# EAGLE design DensityAltitude_BME280_7SEG (EAGLE 7.2.0)
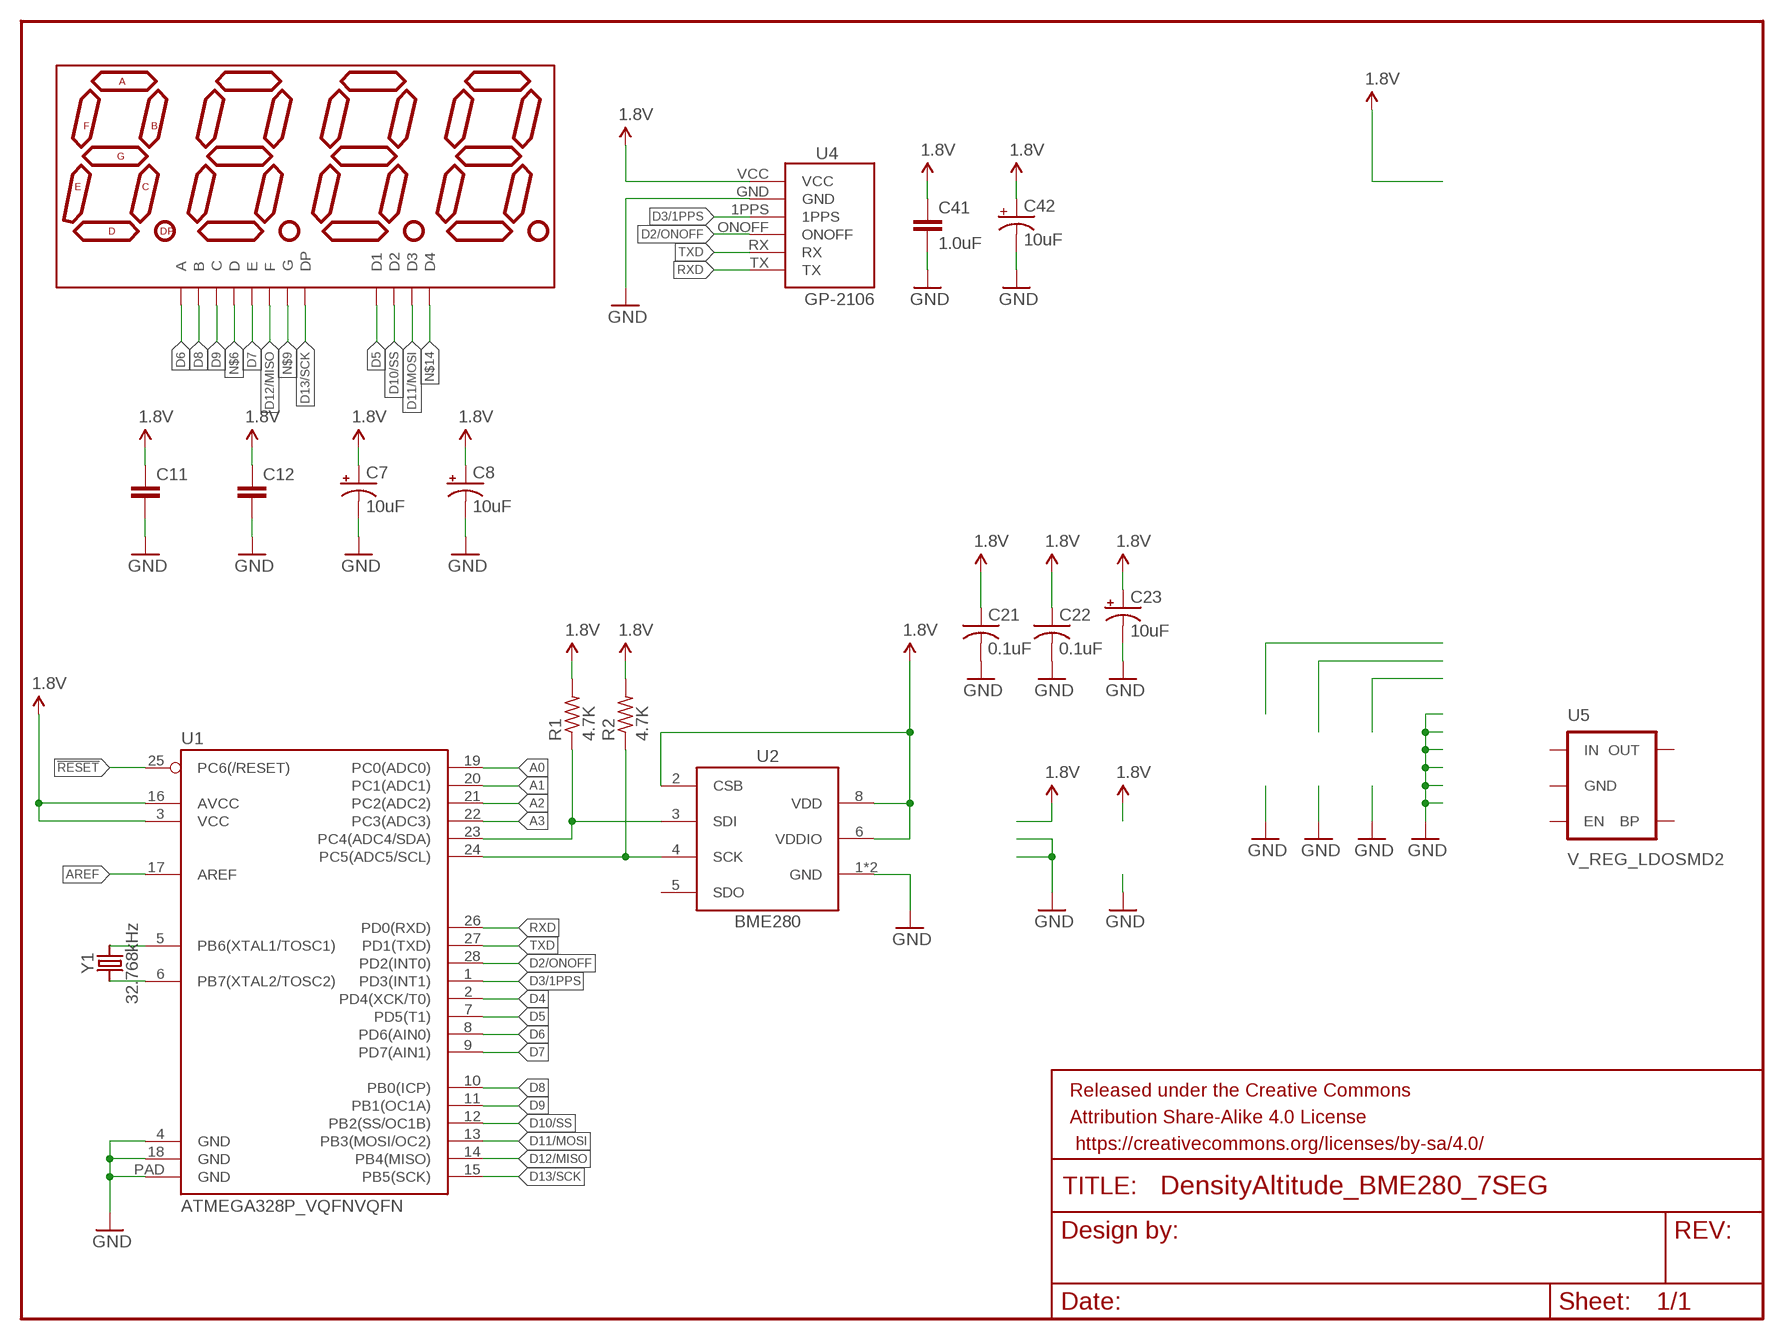
[diagram p0: schematic, sheet 1]

## Parts
C7  10uF  10UF-16V-10%(TANT)  [EIA3216]
C8  10uF  10UF-16V-10%(TANT)  [EIA3216]
C11  CAP0402-CAP  [0402-CAP]
C12  CAP0402-CAP  [0402-CAP]
C21  0.1uF  C-USC0201  [C0201]
C22  0.1uF  C-USC0201  [C0201]
C23  10uF  10UF-16V-10%(TANT)  [EIA3216]
C41  1.0uF  1.0UF-16V-10%(0402)  [0402-CAP]
C42  10uF  10UF-16V-10%(TANT)  [EIA3216]
DISP1  7-SEGMENT-4DIGIT-COUNTER-HP-BUBBLE  [DIL12]
FRAME1  FRAME-LETTER  [CREATIVE_COMMONS]
R1  4.7K  R-US_R0201  [R0201]
R2  4.7K  R-US_R0201  [R0201]
U1  ATMEGA328P_VQFNVQFN  [VQFN-28]
U2  BME280  [BME280]
U4  GP-2106  [GP-2106]
U5  V_REG_LDOSMD2  [SC70]
Y1  32.768kHz  FX12232.768KHZ  [2-SMD]

## Nets
1.8V: C7.A(+) C8.A(+) C11.1 C12.1 C21.1 C22.1 C23.A(+) C41.1 C42.A(+) R1.2 R2.2 U1.3(VCC) U1.16(AVCC) U2.2(CSB) U2.6(VDDIO) U2.8(VDD) U4.VCC
!RESET: U1.25(PC6(/RESET))
A0: U1.19(PC0(ADC0))
A1: U1.20(PC1(ADC1))
A2: U1.21(PC2(ADC2))
A3: U1.22(PC3(ADC3))
A4/SDA: R1.1 U1.23(PC4(ADC4/SDA)) U2.3(SDI)
A5/SCL: R2.1 U1.24(PC5(ADC5/SCL)) U2.4(SCK)
AREF: U1.17(AREF)
D2/ONOFF: U1.28(PD2(INT0)) U4.ONOFF
D3/1PPS: U1.1(PD3(INT1)) U4.1PPS
D4: U1.2(PD4(XCK/T0))
D5: DISP1.1(D1) U1.7(PD5(T1))
D6: DISP1.12(A) U1.8(PD6(AIN0))
D7: DISP1.2(E) U1.9(PD7(AIN1))
D8: DISP1.11(B) U1.10(PB0(ICP))
D9: DISP1.3(C) U1.11(PB1(OC1A))
D10/SS: DISP1.10(D2) U1.12(PB2(SS/OC1B))
D11/MOSI: DISP1.4(D3) U1.13(PB3(MOSI/OC2))
D12/MISO: DISP1.9(F) U1.14(PB4(MISO))
D13/SCK: DISP1.5(DP) U1.15(PB5(SCK))
GND: C7.C(-) C8.C(-) C11.2 C12.2 C21.2 C22.2 C23.C(-) C41.2 C42.C(-) U1.4(GND) U1.18(GND) U1.PAD(GND) U2.1(GND) U2.7(GND) U4.GND
N$4: U1.5(PB6(XTAL1/TOSC1)) Y1.2
N$5: U1.6(PB7(XTAL2/TOSC2)) Y1.1
N$6: DISP1.8(D)
N$9: DISP1.7(G)
N$14: DISP1.6(D4)
RXD: U1.26(PD0(RXD)) U4.TX
TXD: U1.27(PD1(TXD)) U4.RX
Unconnected: U2.5(SDO) U5.1(IN) U5.2(GND) U5.3(EN) U5.4(BP) U5.5(OUT)

## Library data of the parts
C7 C8 C23 C42 = SparkFun-Capacitors:10UF-16V-10%(TANT): CAP-00811 1206/EIA-3216 Tantalum capacitor; PROD_ID: CAP-00811
C11 C12 = SparkFun-Passives:CAP: Capacitor Standard 0603 ceramic capacitor, and 0.1" leaded capacitor.
C21 C22 = rcl:C-US: CAPACITOR, American symbol
C41 = SparkFun-Capacitors:1.0UF-16V-10%(0402); PROD_ID: CAP-12417
DISP1 = DensityAltitude:7-SEGMENT-4DIGIT-COUNTER; STOREFRONT: COM-12710
FRAME1 = SparkFun-Aesthetics:FRAME-LETTER: Schematic Frame Standard 8.5x11 US Letter frame; DESIGNER: NAME; VERSION: v01
R1 R2 = rcl:R-US_: RESISTOR, American symbol
U1 = SparkFun-DigitalIC:ATMEGA328P_VQFN
U2 = DensityAltitude:BME280: BOSCH BME280 Combined humidity and pressure sensor Web page: http://www.bosch-sensortec.com/en/homepage/products_3/environmental_sensors_1/bme280/bme280_1 Datasheet: http://ae-bst.resource.bosch.com/media/products/dokumente/bme280/BST-BME280_DS001-09.pdf The BME280 is an integrated environmental sensor developed specifically for mobile applications where size and low power consumption are key design constraints. The unit combines individual high linearity, high accuracy sensors for pressure, humidity and temperature in an 8-pin metal-lid 2.5 x 2.5 x 0.93 mm3 LGA package, designed for low current consumption (3.6 μA @1Hz), long term stability and high EMC robustness. The humidity sensor features an extremely fast response time which supports performance requirements for emerging applications such as context awareness, and high accuracy over a wide temperature range. The pressure sensor is an absolute barometric pressure sensor with features exceptionally high accuracy and resolution at very low noise. The integrated temperature sensor has been optimized for very low noise and high resolution. It is primarily used for temperature compensation of the pressure and humidity sensors, and can also be used for estimating ambient temperature. The BME280 supports a full suite of operating modes which provides the flexibility to optimize the device for power consumption, resolution and filter performance. Key features: - Temperature measurement included - I2C and SPI interfaces - Fully calibrated - Pb-free, halogen-free and RoHS compliant, - MSL 1 Basic specs: Pressure range: 300 to 1100hPa (+9000m to -500m relating to sea level) Supply voltage: 1.71 to 3.6V (VDD), 1.2V to 3.6V (VDDIO) Package: LGA package with metal lid Small footprint: 2.5mm x 2.5mm Super-flat: 0.93mm height Low power: 3.6μA at 1 sample / sec. in standard mode (humidity, pressure and temperature) Low noise: 0.06hPa (0.5m) in ultra low power mode, 0.02hPa (0.17m) advanced resolution mode Typical applications: - Context awareness, e.g. skin detection, room change detection - Health monitoring / well-being • Warning regarding dehydration or heat stroke • Measurement of lung volume and air flow - Home automation control • Control heating, ventilation, air conditioning (HVAC) - Internet of things - GPS enhancement (e.g. time-to-first-fix improvement, dead reckoning, slope detection) - Indoor navigation (change of floor detection, elevator detection) - Outdoor navigation, leisure and sports applications - Weather forecast - Vertical velocity indication (rise/sink speed)
U4 = DensityAltitude:GP-2106: GP-2106 GPS SiRF IV
U5 = SparkFun-PowerIC:V_REG_LDO: Voltage Regulator LDO Standard 150mA LDO voltage regulator in SOT-23 layout. Micrel part MIC5205. BP (by-pass) pin is used to lower output noise with 470pF cap.
Y1 = fx122:FX122: FX122 - SMD 2.0 x 1.2 Tuning Fork Crystal Technical Specifications: Frequency: 32.768 kHz Frequency Tolerance @ 25ºC: ±20 PPM Frequency Stability Temperature Coefficient: -0.04 PPM / (ΔºC)^2 0.6mm Height Long Term Stability http://www.foxonline.com/pdfs/FX122.pdf; DIGIKEY: 631-1261-1-ND

## Board
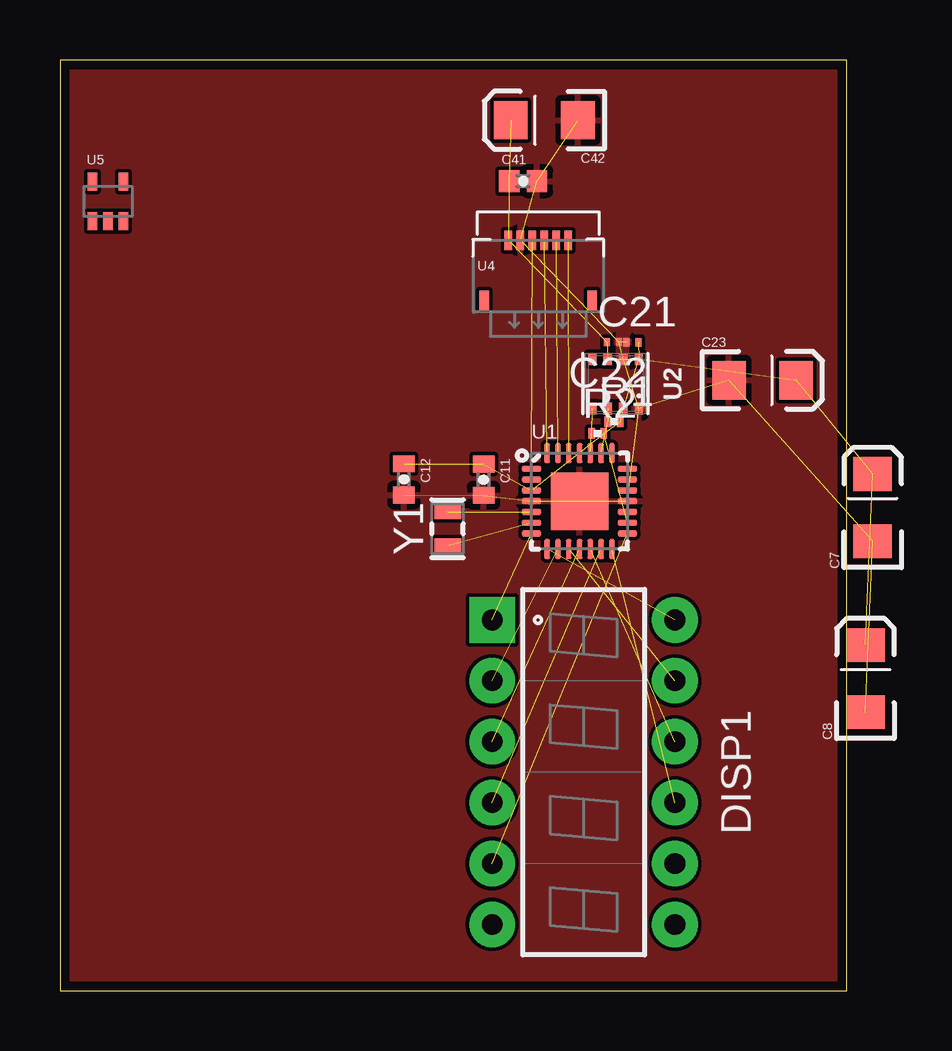
[diagram p1: board, top side]

Size 32.8 x 38.8 mm. Coordinates in mm from the lower left corner, seen from the top.
Outline: 0,0 32.8,0 32.8,38.8 0,38.8 0,0
Copper layers (1*16): Top 0.0356mm / dielectric 1.5011mm / Bottom 0.0356mm
Design rules "oshpark-2layer": minimum track width 6mil, minimum drill 13mil, track to track 6mil, track to pad 6mil, pad to pad 6mil, via to via 6mil, smd to smd 6mil, copper to edge 15mil, drill to drill 6mil, minimum pad ring 7mil, minimum via ring 7mil, stop-mask expansion 4mil, vias tented up to drill 0mil, thermal gap 10mil

### Footprints (pad centres in the part's own frame; a part is rotated, then mirrored left to right if it is on the bottom)
EIA3216 = smd 1.4 x 1.6: A 1.4,0; C -1.4,0
0402-CAP = smd 0.7 x 0.9: 1 -0.65,0; 2 0.65,0
C0201 = smd 0.25 x 0.35: 1 -0.25,0; 2 0.25,0
0402-CAP' = smd 0.85 x 0.9: 1 -0.58,0; 2 0.58,0
DIL12 = drill 0.864 pad 1.905 square: 1 -6.35,-3.81 | drill 0.864 pad 1.905: 2 -3.81,-3.81; 3 -1.27,-3.81; 4 1.27,-3.81; 5 3.81,-3.81; 6 6.35,-3.81; 7 6.35,3.81; 8 3.81,3.81; 9 1.27,3.81; 10 -1.27,3.81; 11 -3.81,3.81; 12 -6.35,3.81
R0201 = smd 0.28 x 0.43: 1 -0.255,0; 2 0.255,0
VQFN-28 = smd 0.82 x 0.24: 1 -2,1.35; 2 -2,0.9; 3 -2,0.45; 4 -2,0; 5 -2,-0.45; 6 -2,-0.9; 7 -2,-1.35; 15 2,-1.35; 16 2,-0.9; 17 2,-0.45; 18 2,0; 19 2,0.45; 20 2,0.9; 21 2,1.35 | smd 0.24 x 0.82: 8 -1.35,-2; 9 -0.9,-2; 10 -0.45,-2; 11 0,-2; 12 0.45,-2; 13 0.9,-2; 14 1.35,-2; 22 1.35,2; 23 0.9,2; 24 0.45,2; 25 0,2; 26 -0.45,2; 27 -0.9,2; 28 -1.35,2 | smd 2.4 x 2.4: PAD 0,0
BME280 = smd 0.5 x 0.35: 1 1.025,0.975; 2 1.025,0.325; 3 1.025,-0.325; 4 1.025,-0.975; 5 -1.025,-0.975; 6 -1.025,-0.325; 7 -1.025,0.325; 8 -1.025,0.975
GP-2106 = smd 0.3 x 0.8: 1PPS -0.25,0; GND -0.75,0; ONOFF 0.25,0; RX 0.75,0; TX 1.25,0; VCC -1.25,0 | smd 0.4 x 0.8: P$7 -2.25,-2.5; P$8 2.25,-2.5
SC70 = smd 0.4 x 0.75: 1 -0.65,-0.825; 2 0,-0.825; 3 0.65,-0.825; 4 0.65,0.825; 5 -0.65,0.825
2-SMD = smd 0.6 x 1.1: 1 -0.7,0; 2 0.7,0

### Placement (x,y rotation side)
C7  33.88,20.14 90 top
C8  33.58,13.01 90 top
C11  17.66,21.3 270 top
C12  14.34,21.32 270 top
C21  23.05,27.04 0 top
C22  23.86,27.04 180 top
C23  29.29,25.45 0 top
C41  1.0uF  [0402-CAP']  19.3,33.75 0 top
C42  20.19,36.29 180 top
DISP1  21.83,9.11 270 top
FRAME1  -11.41,-8.89 0 top  (outside the outline)
R1  23.1,23.72 0 top
R2  22.42,23.23 0 top
U1  21.66,20.41 0 top
U2  23.16,25.3 270 top
U4  19.94,31.28 0 top
U5  2,32.91 0 top
Y1  16.16,19.26 90 top

### Tracks (layer width: path | path; a pad name or v marks a point on that pad's centre or on a via)
1.8V  (16 unrouted)
A4/SDA  (2 unrouted)
A5/SCL  (2 unrouted)
D2/ONOFF  (1 unrouted)
D3/1PPS  (1 unrouted)
D5  (1 unrouted)
D6  (1 unrouted)
D7  (1 unrouted)
D8  (1 unrouted)
D9  (1 unrouted)
D10/SS  (1 unrouted)
D11/MOSI  (1 unrouted)
D12/MISO  (1 unrouted)
D13/SCK  (1 unrouted)
GND  (14 unrouted)
  pour Top: 0,0 32.8,0 32.8,38.8 0,38.8
  pour Top (isolate 0.254, no thermals): 23.26,28.6 23.26,25 23.76,25 23.76,28.6
N$4  (1 unrouted)
N$5  (1 unrouted)
RXD  (1 unrouted)
TXD  (1 unrouted)